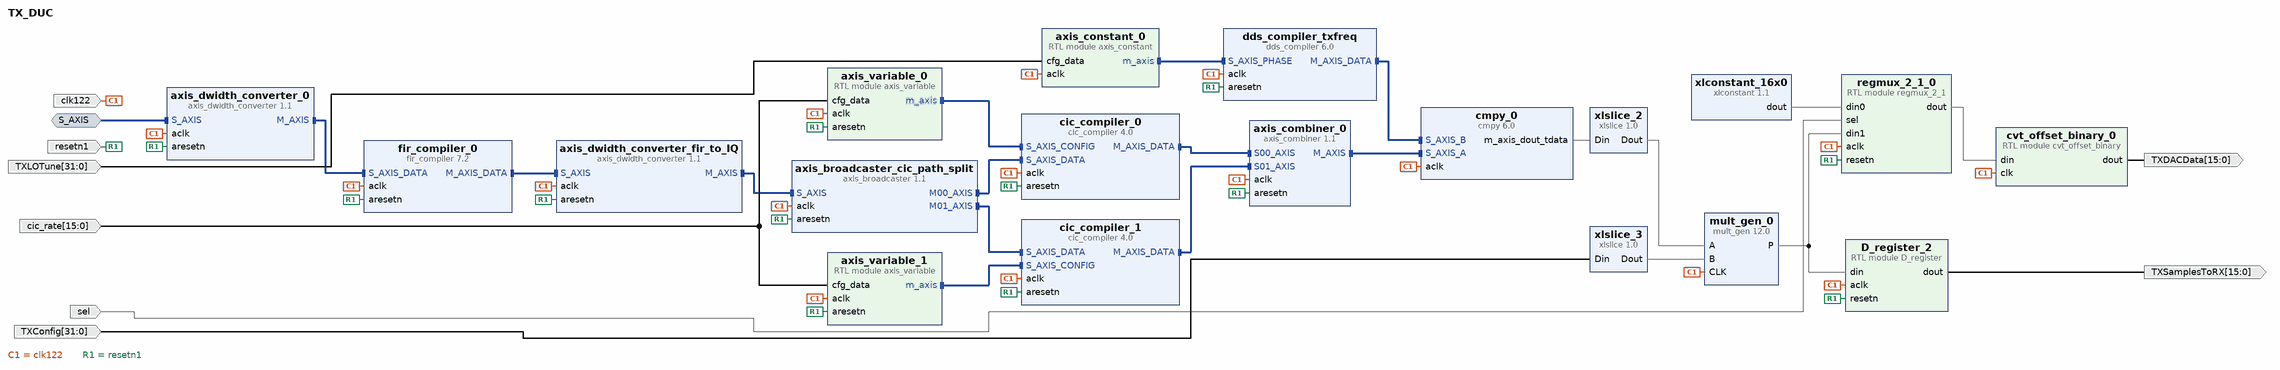
[diagram p0: block diagram of the top level]
# Vivado block design TX_DUC, xc7a200tfbg676-2, Vivado 2023.1
create_bd_design TX_DUC

create_bd_intf_port -mode Slave -vlnv xilinx.com:interface:axis_rtl:1.0 S_AXIS
set_property -dict [list \
  CONFIG.FREQ_HZ 122880000 \
  CONFIG.HAS_TKEEP 0 \
  CONFIG.HAS_TLAST 0 \
  CONFIG.HAS_TREADY 1 \
  CONFIG.HAS_TSTRB 0 \
  CONFIG.LAYERED_METADATA undef \
  CONFIG.TDATA_NUM_BYTES 6 \
  CONFIG.TDEST_WIDTH 0 \
  CONFIG.TID_WIDTH 0 \
  CONFIG.TUSER_WIDTH 0 \
] [get_bd_intf_ports S_AXIS]
create_bd_port -dir I -from 31 -to 0 TXConfig
create_bd_port -dir O -from 15 -to 0 TXDACData
create_bd_port -dir I -from 31 -to 0 TXLOTune
create_bd_port -dir O -from 15 -to 0 TXSamplesToRX
create_bd_port -dir I -from 15 -to 0 cic_rate
create_bd_port -dir I -type clk clk122
set_property -dict {CONFIG.ASSOCIATED_RESET resetn1 CONFIG.FREQ_HZ 122880000} [get_bd_ports clk122]
create_bd_port -dir I -type rst resetn1
create_bd_port -dir I sel

create_bd_cell -type ip -vlnv xilinx.com:ip:xlconstant:1.1 xlconstant_16x0
set_property -dict {CONFIG.CONST_VAL 0 CONFIG.CONST_WIDTH 16} [get_bd_cells xlconstant_16x0]
create_bd_cell -type ip -vlnv xilinx.com:ip:xlslice:1.0 xlslice_2
set_property -dict {CONFIG.DIN_FROM 19 CONFIG.DIN_TO 0 CONFIG.DIN_WIDTH 48 CONFIG.DOUT_WIDTH 20} [get_bd_cells xlslice_2]
create_bd_cell -type ip -vlnv xilinx.com:ip:xlslice:1.0 xlslice_3
set_property -dict {CONFIG.DIN_FROM 21 CONFIG.DIN_TO 4 CONFIG.DOUT_WIDTH 18} [get_bd_cells xlslice_3]
create_bd_cell -type module -reference axis_constant axis_constant_0
create_bd_cell -type module -reference axis_variable axis_variable_0
set_property -dict {CONFIG.AXIS_TDATA_WIDTH 16} [get_bd_cells axis_variable_0]
create_bd_cell -type module -reference axis_variable axis_variable_1
set_property -dict {CONFIG.AXIS_TDATA_WIDTH 16} [get_bd_cells axis_variable_1]
create_bd_cell -type ip -vlnv xilinx.com:ip:axis_broadcaster:1.1 axis_broadcaster_cic_path_split
set_property -dict [list \
  CONFIG.M00_TDATA_REMAP {tdata[31:0]} \
  CONFIG.M01_TDATA_REMAP {tdata[63:32]} \
  CONFIG.M_TDATA_NUM_BYTES 4 \
  CONFIG.S_TDATA_NUM_BYTES 8 \
] [get_bd_cells axis_broadcaster_cic_path_split]
create_bd_cell -type ip -vlnv xilinx.com:ip:axis_combiner:1.1 axis_combiner_0
set_property -dict {CONFIG.TDATA_NUM_BYTES 4} [get_bd_cells axis_combiner_0]
create_bd_cell -type ip -vlnv xilinx.com:ip:axis_dwidth_converter:1.1 axis_dwidth_converter_0
set_property -dict [list \
  CONFIG.HAS_TKEEP 0 \
  CONFIG.HAS_TLAST 0 \
  CONFIG.HAS_TSTRB 0 \
  CONFIG.M_TDATA_NUM_BYTES 3 \
  CONFIG.S_TDATA_NUM_BYTES 6 \
  CONFIG.TDEST_WIDTH 0 \
  CONFIG.TID_WIDTH 0 \
] [get_bd_cells axis_dwidth_converter_0]
create_bd_cell -type ip -vlnv xilinx.com:ip:axis_dwidth_converter:1.1 axis_dwidth_converter_fir_to_IQ
set_property -dict {CONFIG.M_TDATA_NUM_BYTES 8 CONFIG.S_TDATA_NUM_BYTES 4} [get_bd_cells axis_dwidth_converter_fir_to_IQ]
create_bd_cell -type ip -vlnv xilinx.com:ip:cic_compiler:4.0 cic_compiler_0
set_property -dict [list \
  CONFIG.Clock_Frequency 122.88 \
  CONFIG.Fixed_Or_Initial_Rate 80 \
  CONFIG.HAS_ARESETN true \
  CONFIG.HAS_DOUT_TREADY false \
  CONFIG.Input_Data_Width 27 \
  CONFIG.Input_Sample_Frequency 1.536 \
  CONFIG.Maximum_Rate 320 \
  CONFIG.Minimum_Rate 80 \
  CONFIG.Number_Of_Stages 6 \
  CONFIG.Output_Data_Width 32 \
  CONFIG.Quantization Truncation \
  CONFIG.SamplePeriod 80 \
  CONFIG.Sample_Rate_Changes Programmable \
  CONFIG.Use_Xtreme_DSP_Slice false \
] [get_bd_cells cic_compiler_0]
create_bd_cell -type ip -vlnv xilinx.com:ip:cic_compiler:4.0 cic_compiler_1
set_property -dict [list \
  CONFIG.Clock_Frequency 122.88 \
  CONFIG.Fixed_Or_Initial_Rate 80 \
  CONFIG.HAS_ARESETN true \
  CONFIG.HAS_DOUT_TREADY false \
  CONFIG.Input_Data_Width 27 \
  CONFIG.Input_Sample_Frequency 1.536 \
  CONFIG.Maximum_Rate 320 \
  CONFIG.Minimum_Rate 80 \
  CONFIG.Number_Of_Stages 6 \
  CONFIG.Output_Data_Width 32 \
  CONFIG.Quantization Truncation \
  CONFIG.SamplePeriod 80 \
  CONFIG.Sample_Rate_Changes Programmable \
  CONFIG.Use_Xtreme_DSP_Slice false \
] [get_bd_cells cic_compiler_1]
create_bd_cell -type ip -vlnv xilinx.com:ip:cmpy:6.0 cmpy_0
set_property -dict [list \
  CONFIG.APortWidth 32 \
  CONFIG.BPortWidth 23 \
  CONFIG.FlowControl NonBlocking \
  CONFIG.HasATLAST false \
  CONFIG.MinimumLatency 9 \
  CONFIG.OutTLASTBehv Null \
  CONFIG.OutputWidth 24 \
  CONFIG.RoundMode Truncate \
] [get_bd_cells cmpy_0]
create_bd_cell -type ip -vlnv xilinx.com:ip:dds_compiler:6.0 dds_compiler_txfreq
set_property -dict [list \
  CONFIG.Amplitude_Mode Full_Range \
  CONFIG.DATA_Has_TLAST Not_Required \
  CONFIG.DDS_Clock_Rate 122.88 \
  CONFIG.DSP48_Use Minimal \
  CONFIG.Frequency_Resolution 0.05 \
  CONFIG.Has_ARESETn true \
  CONFIG.Has_Phase_Out false \
  CONFIG.Latency 10 \
  CONFIG.M_DATA_Has_TUSER Not_Required \
  CONFIG.Noise_Shaping Auto \
  CONFIG.Output_Frequency1 0 \
  CONFIG.Output_Width 23 \
  CONFIG.PINC1 0 \
  CONFIG.Phase_Increment Streaming \
  CONFIG.Phase_Width 32 \
  CONFIG.S_PHASE_Has_TUSER Not_Required \
  CONFIG.Spurious_Free_Dynamic_Range 130 \
] [get_bd_cells dds_compiler_txfreq]
create_bd_cell -type ip -vlnv xilinx.com:ip:fir_compiler:7.2 fir_compiler_0
set_property -dict [list \
  CONFIG.BestPrecision true \
  CONFIG.Clock_Frequency 122.88 \
  CONFIG.CoefficientSource COE_File \
  CONFIG.Coefficient_File ../../../../../../../sources/coefficientfiles/tx1024cfirImpulse.coe \
  CONFIG.Coefficient_Fractional_Bits 24 \
  CONFIG.Coefficient_Sets 1 \
  CONFIG.Coefficient_Sign Signed \
  CONFIG.Coefficient_Structure Inferred \
  CONFIG.Coefficient_Width 22 \
  CONFIG.ColumnConfig 2 \
  CONFIG.DATA_Has_TLAST Not_Required \
  CONFIG.Data_Fractional_Bits 0 \
  CONFIG.Data_Width 24 \
  CONFIG.Decimation_Rate 1 \
  CONFIG.Filter_Architecture Systolic_Multiply_Accumulate \
  CONFIG.Filter_Type Interpolation \
  CONFIG.Has_ARESETn true \
  CONFIG.Interpolation_Rate 8 \
  CONFIG.M_DATA_Has_TREADY true \
  CONFIG.M_DATA_Has_TUSER Not_Required \
  CONFIG.Number_Channels 2 \
  CONFIG.Output_Rounding_Mode Truncate_LSBs \
  CONFIG.Output_Width 27 \
  CONFIG.Quantization Quantize_Only \
  CONFIG.RateSpecification Frequency_Specification \
  CONFIG.S_DATA_Has_TUSER Not_Required \
  CONFIG.Sample_Frequency 0.192 \
  CONFIG.Select_Pattern All \
  CONFIG.Zero_Pack_Factor 1 \
] [get_bd_cells fir_compiler_0]
create_bd_cell -type ip -vlnv xilinx.com:ip:mult_gen:12.0 mult_gen_0
set_property -dict [list \
  CONFIG.MultType Parallel_Multiplier \
  CONFIG.Multiplier_Construction Use_Mults \
  CONFIG.OptGoal Speed \
  CONFIG.OutputWidthHigh 32 \
  CONFIG.OutputWidthLow 17 \
  CONFIG.PipeStages 4 \
  CONFIG.PortAWidth 20 \
  CONFIG.PortBType Unsigned \
  CONFIG.Use_Custom_Output_Width true \
] [get_bd_cells mult_gen_0]
create_bd_cell -type module -reference D_register D_register_2
set_property -dict {CONFIG.DATA_WIDTH 16} [get_bd_cells D_register_2]
create_bd_cell -type module -reference regmux_2_1 regmux_2_1_0
set_property -dict {CONFIG.DATA_WIDTH 16} [get_bd_cells regmux_2_1_0]
create_bd_cell -type module -reference cvt_offset_binary cvt_offset_binary_0

# ---- connections ----

connect_bd_intf_net [get_bd_intf_ports S_AXIS] [get_bd_intf_pins axis_dwidth_converter_0/S_AXIS]
connect_bd_intf_net -intf_net axis_broadcaster_0_M00_AXIS [get_bd_intf_pins axis_broadcaster_cic_path_split/M00_AXIS] [get_bd_intf_pins cic_compiler_0/S_AXIS_DATA]
connect_bd_intf_net -intf_net axis_broadcaster_0_M01_AXIS [get_bd_intf_pins axis_broadcaster_cic_path_split/M01_AXIS] [get_bd_intf_pins cic_compiler_1/S_AXIS_DATA]
connect_bd_intf_net [get_bd_intf_pins axis_combiner_0/M_AXIS] [get_bd_intf_pins cmpy_0/S_AXIS_A]
connect_bd_intf_net [get_bd_intf_pins axis_constant_0/m_axis] [get_bd_intf_pins dds_compiler_txfreq/S_AXIS_PHASE]
connect_bd_intf_net [get_bd_intf_pins axis_dwidth_converter_0/M_AXIS] [get_bd_intf_pins fir_compiler_0/S_AXIS_DATA]
connect_bd_intf_net [get_bd_intf_pins axis_broadcaster_cic_path_split/S_AXIS] [get_bd_intf_pins axis_dwidth_converter_fir_to_IQ/M_AXIS]
connect_bd_intf_net [get_bd_intf_pins axis_variable_0/m_axis] [get_bd_intf_pins cic_compiler_0/S_AXIS_CONFIG]
connect_bd_intf_net [get_bd_intf_pins axis_variable_1/m_axis] [get_bd_intf_pins cic_compiler_1/S_AXIS_CONFIG]
connect_bd_intf_net [get_bd_intf_pins axis_combiner_0/S00_AXIS] [get_bd_intf_pins cic_compiler_0/M_AXIS_DATA]
connect_bd_intf_net [get_bd_intf_pins axis_combiner_0/S01_AXIS] [get_bd_intf_pins cic_compiler_1/M_AXIS_DATA]
connect_bd_intf_net [get_bd_intf_pins dds_compiler_txfreq/M_AXIS_DATA] [get_bd_intf_pins cmpy_0/S_AXIS_B]
connect_bd_intf_net [get_bd_intf_pins axis_dwidth_converter_fir_to_IQ/S_AXIS] [get_bd_intf_pins fir_compiler_0/M_AXIS_DATA]
connect_bd_net [get_bd_pins D_register_2/dout] [get_bd_ports TXSamplesToRX]
connect_bd_net -net IQ_Modulation_Select_TX_OPENABLE [get_bd_ports sel] [get_bd_pins regmux_2_1_0/sel]
connect_bd_net [get_bd_ports clk122] \
  [get_bd_pins axis_constant_0/aclk] [get_bd_pins axis_variable_0/aclk] [get_bd_pins axis_variable_1/aclk] \
  [get_bd_pins axis_broadcaster_cic_path_split/aclk] [get_bd_pins axis_combiner_0/aclk] \
  [get_bd_pins axis_dwidth_converter_0/aclk] [get_bd_pins axis_dwidth_converter_fir_to_IQ/aclk] \
  [get_bd_pins cic_compiler_0/aclk] [get_bd_pins cic_compiler_1/aclk] [get_bd_pins cmpy_0/aclk] \
  [get_bd_pins dds_compiler_txfreq/aclk] [get_bd_pins fir_compiler_0/aclk] [get_bd_pins mult_gen_0/CLK] \
  [get_bd_pins D_register_2/aclk] [get_bd_pins regmux_2_1_0/aclk] [get_bd_pins cvt_offset_binary_0/clk]
connect_bd_net [get_bd_ports TXConfig] [get_bd_pins xlslice_3/Din]
connect_bd_net -net TX_LO_Tune_1 [get_bd_ports TXLOTune] [get_bd_pins axis_constant_0/cfg_data]
connect_bd_net [get_bd_pins cmpy_0/m_axis_dout_tdata] [get_bd_pins xlslice_2/Din]
connect_bd_net [get_bd_pins cvt_offset_binary_0/dout] [get_bd_ports TXDACData]
connect_bd_net [get_bd_pins mult_gen_0/P] [get_bd_pins D_register_2/din] [get_bd_pins regmux_2_1_0/din1]
connect_bd_net [get_bd_pins regmux_2_1_0/dout] [get_bd_pins cvt_offset_binary_0/din]
connect_bd_net -net regmux_2_1_1_dout1 [get_bd_ports cic_rate] [get_bd_pins axis_variable_0/cfg_data] [get_bd_pins axis_variable_1/cfg_data]
connect_bd_net [get_bd_ports resetn1] \
  [get_bd_pins axis_variable_0/aresetn] [get_bd_pins axis_variable_1/aresetn] \
  [get_bd_pins axis_broadcaster_cic_path_split/aresetn] [get_bd_pins axis_combiner_0/aresetn] \
  [get_bd_pins axis_dwidth_converter_0/aresetn] [get_bd_pins axis_dwidth_converter_fir_to_IQ/aresetn] \
  [get_bd_pins cic_compiler_0/aresetn] [get_bd_pins cic_compiler_1/aresetn] [get_bd_pins dds_compiler_txfreq/aresetn] \
  [get_bd_pins fir_compiler_0/aresetn] [get_bd_pins D_register_2/resetn] [get_bd_pins regmux_2_1_0/resetn]
connect_bd_net [get_bd_pins xlconstant_16x0/dout] [get_bd_pins regmux_2_1_0/din0]
connect_bd_net [get_bd_pins xlslice_2/Dout] [get_bd_pins mult_gen_0/A]
connect_bd_net [get_bd_pins xlslice_3/Dout] [get_bd_pins mult_gen_0/B]

validate_bd_design
save_bd_design
